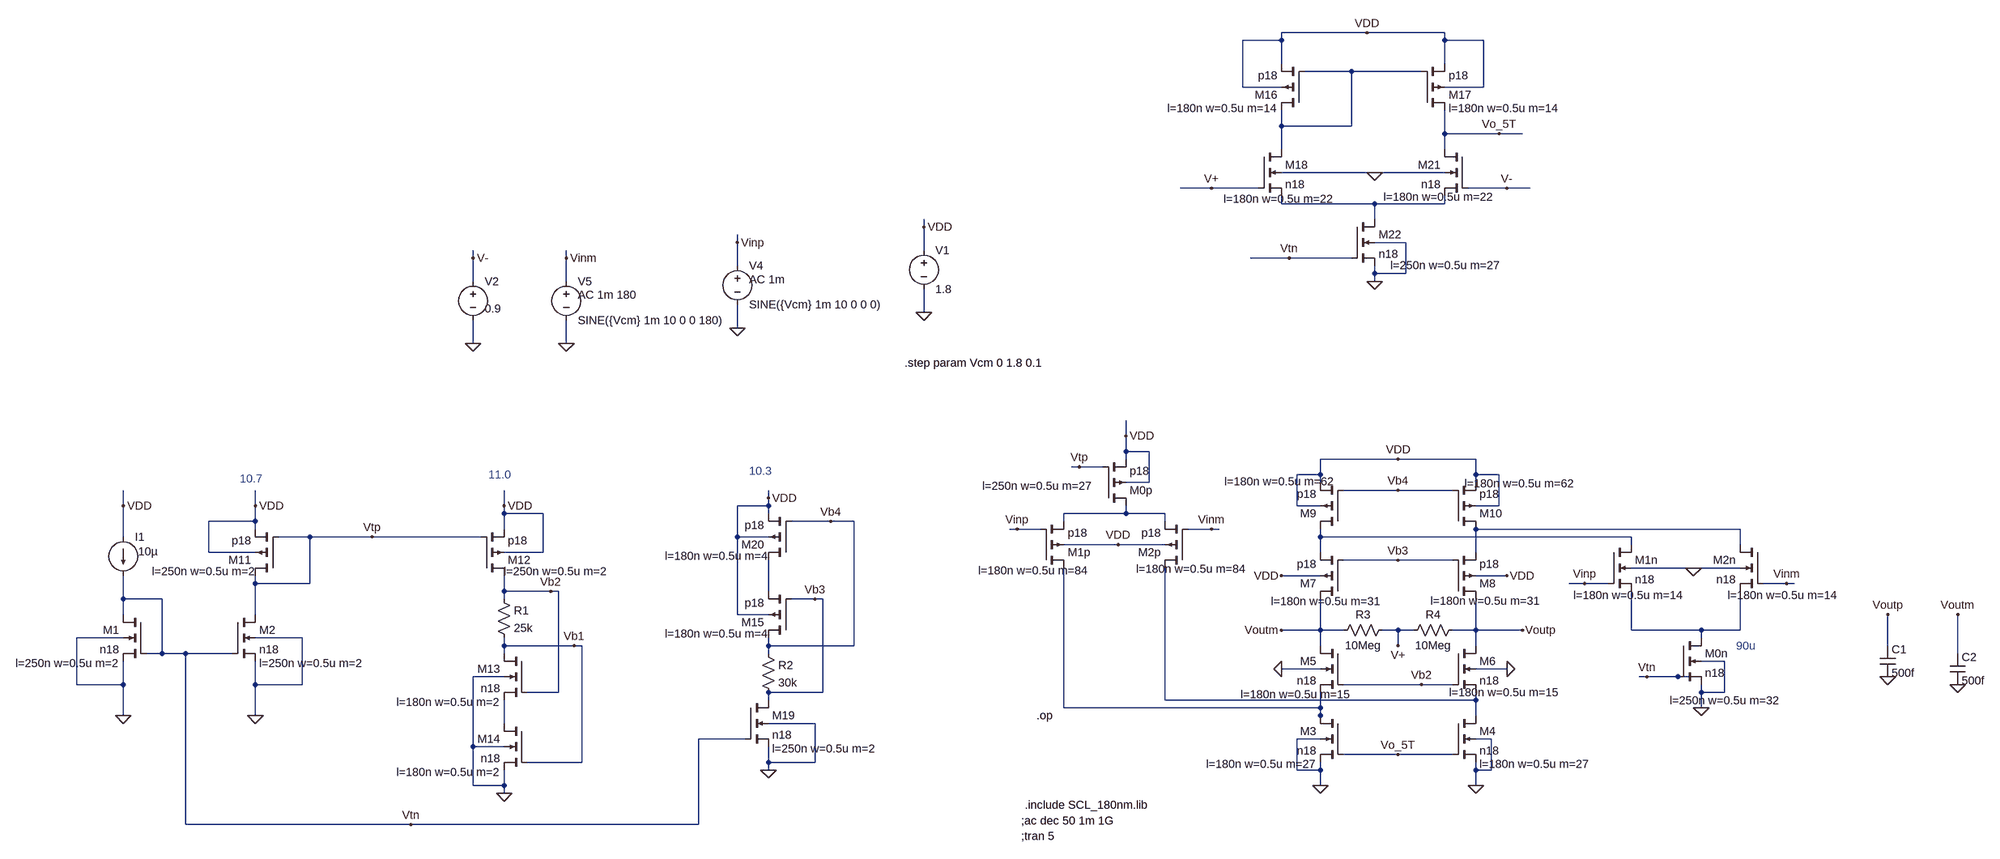
[diagram p0: schematic Rail to Rail Input Folded Cascode.asc]
Rail to Rail Input Folded Cascode.asc, the LTspice schematic file:
Version 4
SHEET 1 1728 680
WIRE 448 -1312 272 -1312
WIRE 608 -1312 448 -1312
WIRE 272 -1296 272 -1312
WIRE 272 -1296 192 -1296
WIRE 608 -1296 608 -1312
WIRE 688 -1296 608 -1296
WIRE 272 -1248 272 -1296
WIRE 608 -1248 608 -1296
WIRE 416 -1232 320 -1232
WIRE 560 -1232 416 -1232
WIRE 192 -1200 192 -1296
WIRE 272 -1200 192 -1200
WIRE 688 -1200 688 -1296
WIRE 688 -1200 608 -1200
WIRE 272 -1120 272 -1152
WIRE 416 -1120 416 -1232
WIRE 416 -1120 272 -1120
WIRE 608 -1104 608 -1152
WIRE 720 -1104 608 -1104
WIRE 768 -1104 720 -1104
WIRE 272 -1072 272 -1120
WIRE 608 -1072 608 -1104
WIRE 464 -1024 272 -1024
WIRE 608 -1024 464 -1024
WIRE 128 -992 64 -992
WIRE 224 -992 128 -992
WIRE 736 -992 656 -992
WIRE 784 -992 736 -992
WIRE 272 -960 272 -976
WIRE 464 -960 272 -960
WIRE 608 -960 608 -976
WIRE 608 -960 464 -960
WIRE 464 -928 464 -960
WIRE -464 -912 -464 -928
WIRE -848 -880 -848 -896
WIRE 528 -880 464 -880
WIRE -464 -864 -464 -912
WIRE -1392 -848 -1392 -864
WIRE -1200 -848 -1200 -864
WIRE 288 -848 208 -848
WIRE 416 -848 288 -848
WIRE -848 -832 -848 -880
WIRE 464 -816 464 -832
WIRE 528 -816 528 -880
WIRE 528 -816 464 -816
WIRE -1392 -800 -1392 -848
WIRE -1200 -800 -1200 -848
WIRE 464 -800 464 -816
WIRE -464 -736 -464 -784
WIRE -848 -704 -848 -752
WIRE -1392 -672 -1392 -720
WIRE -1200 -672 -1200 -720
WIRE -48 -352 -48 -384
WIRE -48 -320 -48 -352
WIRE 0 -320 -48 -320
WIRE -48 -304 -48 -320
WIRE 512 -304 352 -304
WIRE 672 -304 512 -304
WIRE -144 -288 -160 -288
WIRE -96 -288 -144 -288
WIRE 352 -272 352 -304
WIRE 352 -272 304 -272
WIRE 672 -272 672 -304
WIRE 720 -272 672 -272
WIRE 0 -256 0 -320
WIRE 0 -256 -48 -256
WIRE 352 -256 352 -272
WIRE 672 -256 672 -272
WIRE 512 -240 400 -240
WIRE 624 -240 512 -240
WIRE -784 -224 -784 -240
WIRE -2112 -208 -2112 -240
WIRE -1840 -208 -1840 -240
WIRE -1328 -208 -1328 -240
WIRE -784 -208 -784 -224
WIRE -784 -208 -848 -208
WIRE 304 -208 304 -272
WIRE 352 -208 304 -208
WIRE 720 -208 720 -272
WIRE 720 -208 672 -208
WIRE -1328 -192 -1328 -208
WIRE -1248 -192 -1328 -192
WIRE -784 -192 -784 -208
WIRE -48 -192 -48 -208
WIRE -48 -192 -176 -192
WIRE 32 -192 -48 -192
WIRE -1840 -176 -1840 -208
WIRE -1840 -176 -1936 -176
WIRE -656 -176 -736 -176
WIRE -608 -176 -656 -176
WIRE -176 -176 -176 -192
WIRE 32 -176 32 -192
WIRE -1840 -160 -1840 -176
WIRE -1328 -160 -1328 -192
WIRE -272 -160 -288 -160
WIRE -224 -160 -272 -160
WIRE 128 -160 80 -160
WIRE 144 -160 128 -160
WIRE 1216 -160 672 -160
WIRE -2112 -144 -2112 -208
WIRE -1728 -144 -1792 -144
WIRE -1600 -144 -1728 -144
WIRE -1376 -144 -1600 -144
WIRE -848 -144 -848 -208
WIRE -784 -144 -848 -144
WIRE 352 -144 352 -160
WIRE 992 -144 352 -144
WIRE -64 -128 -176 -128
WIRE 32 -128 -64 -128
WIRE 992 -128 992 -144
WIRE 1216 -128 1216 -160
WIRE -1936 -112 -1936 -176
WIRE -1840 -112 -1936 -112
WIRE -1248 -112 -1248 -192
WIRE -1248 -112 -1328 -112
WIRE 352 -112 352 -144
WIRE 672 -112 672 -160
WIRE 512 -96 400 -96
WIRE 624 -96 512 -96
WIRE 1120 -80 992 -80
WIRE 1216 -80 1120 -80
WIRE 352 -64 272 -64
WIRE 736 -64 672 -64
WIRE -1840 -48 -1840 -64
WIRE -1728 -48 -1728 -144
WIRE -1728 -48 -1840 -48
WIRE 896 -48 864 -48
WIRE 944 -48 896 -48
WIRE 1312 -48 1264 -48
WIRE 1328 -48 1312 -48
WIRE -1328 -32 -1328 -64
WIRE -1232 -32 -1328 -32
WIRE -1216 -32 -1232 -32
WIRE -784 -32 -784 -96
WIRE -2112 -16 -2112 -64
WIRE -2032 -16 -2112 -16
WIRE -1328 -16 -1328 -32
WIRE -688 -16 -736 -16
WIRE -672 -16 -688 -16
WIRE -2112 16 -2112 -16
WIRE -1840 16 -1840 -48
WIRE -848 16 -848 -144
WIRE -784 16 -848 16
WIRE 352 48 352 -16
WIRE 352 48 272 48
WIRE 400 48 352 48
WIRE 512 48 480 48
WIRE 544 48 512 48
WIRE 672 48 672 -16
WIRE 672 48 624 48
WIRE 768 48 672 48
WIRE 992 48 992 -32
WIRE 1136 48 992 48
WIRE 1216 48 1216 -32
WIRE 1216 48 1136 48
WIRE -2112 64 -2208 64
WIRE -1744 64 -1840 64
WIRE 1136 64 1136 48
WIRE -1328 80 -1328 64
WIRE -1184 80 -1328 80
WIRE -1168 80 -1184 80
WIRE -784 80 -784 64
WIRE -608 80 -608 -176
WIRE -608 80 -784 80
WIRE 352 80 352 48
WIRE 512 80 512 48
WIRE 672 80 672 48
WIRE 1520 80 1520 16
WIRE -2032 96 -2032 -16
WIRE -2032 96 -2064 96
WIRE -1984 96 -2032 96
WIRE -1888 96 -1984 96
WIRE -1328 96 -1328 80
WIRE -784 96 -784 80
WIRE 1664 96 1664 16
WIRE 1184 112 1136 112
WIRE 352 128 272 128
WIRE 736 128 672 128
WIRE -1328 144 -1392 144
WIRE 1024 144 1008 144
WIRE 1088 144 1024 144
WIRE 1120 144 1088 144
WIRE -2208 160 -2208 64
WIRE -2112 160 -2112 112
WIRE -2112 160 -2208 160
WIRE -1840 160 -1840 112
WIRE -1744 160 -1744 64
WIRE -1744 160 -1840 160
WIRE 560 160 400 160
WIRE 624 160 560 160
WIRE -1216 176 -1216 -32
WIRE -1216 176 -1280 176
WIRE -672 176 -672 -16
WIRE -672 176 -784 176
WIRE 1136 176 1136 160
WIRE 1184 176 1184 112
WIRE 1184 176 1136 176
WIRE -784 192 -784 176
WIRE 32 192 32 -80
WIRE 672 192 672 176
WIRE 672 192 32 192
WIRE -176 208 -176 -80
WIRE 352 208 352 176
WIRE 352 208 -176 208
WIRE 1136 208 1136 176
WIRE -2112 224 -2112 160
WIRE -1840 224 -1840 160
WIRE 352 224 352 208
WIRE 672 224 672 192
WIRE -1328 240 -1328 192
WIRE -688 240 -784 240
WIRE 352 240 352 224
WIRE -832 272 -928 272
WIRE 352 272 304 272
WIRE 704 272 672 272
WIRE -1392 288 -1392 144
WIRE -1328 288 -1392 288
WIRE 512 304 400 304
WIRE 624 304 512 304
WIRE -1168 320 -1168 80
WIRE -1168 320 -1280 320
WIRE -784 320 -784 288
WIRE -688 320 -688 240
WIRE -688 320 -784 320
WIRE -784 336 -784 320
WIRE 304 336 304 272
WIRE 352 336 352 320
WIRE 352 336 304 336
WIRE 672 336 672 320
WIRE 704 336 704 272
WIRE 704 336 672 336
WIRE -1392 368 -1392 288
WIRE -1328 368 -1328 336
WIRE -1328 368 -1392 368
WIRE 352 368 352 336
WIRE 672 368 672 336
WIRE -1328 384 -1328 368
WIRE -1984 448 -1984 96
WIRE -1520 448 -1984 448
WIRE -928 448 -928 272
WIRE -928 448 -1520 448
FLAG -48 -352 VDD
FLAG 352 368 0
FLAG 672 368 0
FLAG 1136 208 0
FLAG 512 -304 VDD
FLAG 272 -64 VDD
FLAG 736 -64 VDD
FLAG -64 -128 VDD
FLAG 736 128 0
FLAG 272 128 0
FLAG 1120 -80 0
FLAG -464 -736 0
FLAG -464 -912 VDD
FLAG 512 -96 Vb3
FLAG 512 -240 Vb4
FLAG -144 -288 Vtp
FLAG 1024 144 Vtn
FLAG 1312 -48 Vinm
FLAG 128 -160 Vinm
FLAG -272 -160 Vinp
FLAG 896 -48 Vinp
FLAG 272 48 Voutm
FLAG 768 48 Voutp
FLAG -848 -704 0
FLAG -848 -880 Vinp
FLAG -1200 -672 0
FLAG -1200 -848 Vinm
FLAG 1520 144 0
FLAG 1664 160 0
FLAG 1664 16 Voutm
FLAG 1520 16 Voutp
FLAG -2112 224 0
FLAG -2112 -208 VDD
FLAG -1840 224 0
FLAG -1840 -208 VDD
FLAG -1328 -208 VDD
FLAG -1328 384 0
FLAG -784 336 0
FLAG -784 -224 VDD
FLAG -656 -176 Vb4
FLAG -688 -16 Vb3
FLAG -1232 -32 Vb2
FLAG -1184 80 Vb1
FLAG -1600 -144 Vtp
FLAG -1520 448 Vtn
FLAG 560 160 Vb2
FLAG 464 -800 0
FLAG 720 -1104 Vo_5T
FLAG 448 -1312 VDD
FLAG 128 -992 V+
FLAG 736 -992 V-
FLAG 464 -1024 0
FLAG 288 -848 Vtn
FLAG -1392 -672 0
FLAG -1392 -848 V-
FLAG 512 80 V+
FLAG 512 304 Vo_5T
DATAFLAG 352 -144 ""
DATAFLAG 352 208 ""
DATAFLAG -48 -192 ""
DATAFLAG 1040 48 ""
DATAFLAG 304 48 ""
DATAFLAG 768 -1104 ""
SYMBOL pmos4 -96 -208 M180
WINDOW 123 -248 41 Left 2
SYMATTR Value2 l=250n w=0.5u m=27
SYMATTR InstName M0p
SYMATTR Value p18
SYMBOL pmos4 624 -16 M180
WINDOW 123 -45 -4 Left 2
SYMATTR Value2 l=180n w=0.5u m=31
SYMATTR InstName M8
SYMATTR Value p18
SYMBOL pmos4 400 -16 R180
WINDOW 123 -78 -5 Left 2
SYMATTR Value2 l=180n w=0.5u m=31
SYMATTR InstName M7
SYMATTR Value p18
SYMBOL pmos4 624 -160 M180
WINDOW 123 25 94 Left 2
SYMATTR Value2 l=180n w=0.5u m=62
SYMATTR InstName M10
SYMATTR Value p18
SYMBOL pmos4 400 -160 R180
WINDOW 123 18 98 Left 2
SYMATTR Value2 l=180n w=0.5u m=62
SYMATTR InstName M9
SYMATTR Value p18
SYMBOL nmos4 624 80 R0
WINDOW 123 -7 96 Left 2
SYMATTR Value2 l=180n w=0.5u m=15
SYMATTR InstName M6
SYMATTR Value n18
SYMBOL nmos4 624 224 R0
WINDOW 123 56 100 Left 2
SYMATTR Value2 l=180n w=0.5u m=27
SYMATTR InstName M4
SYMATTR Value n18
SYMBOL nmos4 400 80 M0
WINDOW 123 -15 100 Left 2
SYMATTR Value2 l=180n w=0.5u m=15
SYMATTR InstName M5
SYMATTR Value n18
SYMBOL nmos4 400 224 M0
WINDOW 123 56 100 Left 2
SYMATTR Value2 l=180n w=0.5u m=27
SYMATTR InstName M3
SYMATTR Value n18
SYMBOL pmos4 80 -80 R180
WINDOW 123 -120 -2 Left 2
SYMATTR Value2 l=180n w=0.5u m=84
SYMATTR InstName M2p
SYMATTR Value p18
SYMBOL pmos4 -224 -80 M180
WINDOW 123 -128 -5 Left 2
SYMATTR Value2 l=180n w=0.5u m=84
SYMATTR InstName M1p
SYMATTR Value p18
SYMBOL nmos4 1264 -128 M0
WINDOW 123 -154 104 Left 2
SYMATTR Value2 l=180n w=0.5u m=14
SYMATTR InstName M2n
SYMATTR Value n18
SYMBOL nmos4 944 -128 R0
WINDOW 123 -71 104 Left 2
SYMATTR Value2 l=180n w=0.5u m=14
SYMATTR InstName M1n
SYMATTR Value n18
SYMBOL nmos4 1088 64 R0
WINDOW 123 -17 129 Left 2
SYMATTR Value2 l=250n w=0.5u m=32
SYMATTR InstName M0n
SYMATTR Value n18
SYMBOL voltage -464 -880 R0
WINDOW 123 0 0 Left 0
WINDOW 39 0 0 Left 0
SYMATTR InstName V1
SYMATTR Value 1.8
SYMBOL voltage -848 -848 R0
WINDOW 123 24 44 Left 2
WINDOW 39 0 0 Left 0
SYMATTR Value2 AC 1m
SYMATTR InstName V4
SYMATTR Value SINE({Vcm} 1m 10 0 0 0)
SYMBOL voltage -1200 -816 R0
WINDOW 123 24 44 Left 2
WINDOW 39 0 0 Left 0
SYMATTR Value2 AC 1m 180
SYMATTR InstName V5
SYMATTR Value SINE({Vcm} 1m 10 0 0 180)
SYMBOL cap 1504 80 R0
SYMATTR InstName C1
SYMATTR Value 500f
SYMBOL cap 1648 96 R0
SYMATTR InstName C2
SYMATTR Value 500f
SYMBOL current -2112 -144 R0
WINDOW 123 0 0 Left 0
WINDOW 39 0 0 Left 0
WINDOW 3 31 30 Left 2
SYMATTR Value 10µ
SYMATTR InstName I1
SYMBOL nmos4 -2064 16 M0
WINDOW 123 56 100 Left 2
SYMATTR Value2 l=250n w=0.5u m=2
SYMATTR InstName M1
SYMATTR Value n18
SYMBOL nmos4 -1888 16 R0
WINDOW 123 56 100 Left 2
SYMATTR Value2 l=250n w=0.5u m=2
SYMATTR InstName M2
SYMATTR Value n18
SYMBOL pmos4 -1792 -64 R180
WINDOW 123 47 9 Left 2
SYMATTR Value2 l=250n w=0.5u m=2
SYMATTR InstName M11
SYMATTR Value p18
SYMBOL pmos4 -1376 -64 M180
WINDOW 123 47 9 Left 2
SYMATTR Value2 l=250n w=0.5u m=2
SYMATTR InstName M12
SYMATTR Value p18
SYMBOL res -1344 -32 R0
SYMATTR InstName R1
SYMATTR Value 25k
SYMBOL res -800 80 R0
SYMATTR InstName R2
SYMATTR Value 30k
SYMBOL nmos4 -1280 96 M0
WINDOW 123 56 100 Left 2
SYMATTR Value2 l=180n w=0.5u m=2
SYMATTR InstName M13
SYMATTR Value n18
SYMBOL nmos4 -1280 240 M0
WINDOW 123 56 100 Left 2
SYMATTR Value2 l=180n w=0.5u m=2
SYMATTR InstName M14
SYMATTR Value n18
SYMBOL pmos4 -736 64 R180
WINDOW 123 47 9 Left 2
SYMATTR Value2 l=180n w=0.5u m=4
SYMATTR InstName M15
SYMATTR Value p18
SYMBOL nmos4 -832 192 R0
WINDOW 123 56 100 Left 2
SYMATTR Value2 l=250n w=0.5u m=2
SYMATTR InstName M19
SYMATTR Value n18
SYMBOL pmos4 -736 -96 R180
WINDOW 123 47 9 Left 2
SYMATTR Value2 l=180n w=0.5u m=4
SYMATTR InstName M20
SYMATTR Value p18
SYMBOL res 496 32 R90
WINDOW 0 0 56 VBottom 2
WINDOW 3 32 56 VTop 2
SYMATTR InstName R3
SYMATTR Value 10Meg
SYMBOL res 640 32 R90
WINDOW 0 0 56 VBottom 2
WINDOW 3 32 56 VTop 2
SYMATTR InstName R4
SYMATTR Value 10Meg
SYMBOL pmos4 320 -1152 R180
WINDOW 123 56 4 Left 2
SYMATTR InstName M16
SYMATTR Value p18
SYMATTR Value2 l=180n w=0.5u m=14
SYMBOL pmos4 560 -1152 M180
WINDOW 123 56 4 Left 2
SYMATTR InstName M17
SYMATTR Value p18
SYMATTR Value2 l=180n w=0.5u m=14
SYMBOL nmos4 224 -1072 R0
WINDOW 123 -71 102 Left 2
SYMATTR InstName M18
SYMATTR Value n18
SYMATTR Value2 l=180n w=0.5u m=22
SYMBOL nmos4 656 -1072 M0
WINDOW 123 -53 98 Left 2
SYMATTR InstName M21
SYMATTR Value n18
SYMATTR Value2 l=180n w=0.5u m=22
SYMBOL nmos4 416 -928 R0
WINDOW 123 80 95 Left 2
SYMATTR InstName M22
SYMATTR Value n18
SYMATTR Value2 l=250n w=0.5u m=27
SYMBOL voltage -1392 -816 R0
WINDOW 123 24 44 Left 2
WINDOW 39 0 0 Left 0
WINDOW 3 24 72 Left 2
SYMATTR InstName V2
SYMATTR Value 0.9
TEXT -256 408 Left 2 !.include SCL_180nm.lib
TEXT 1208 80 Left 2 ;90u
TEXT -232 224 Left 2 !.op
TEXT -1872 -264 Left 2 ;10.7
TEXT -1360 -272 Left 2 ;11.0
TEXT -824 -280 Left 2 ;10.3
TEXT -264 440 Left 2 !;ac dec 50 1m 1G
TEXT -264 472 Left 2 !;tran 5
TEXT -504 -632 Left 2 !.step param Vcm 0 1.8 0.1

The netlist it stands for:
* Rail to Rail Input Folded Cascode.asc
M0p N003 Vtp VDD VDD p18 l=250n w=0.5u m=27
M8 Voutp Vb3 N004 VDD p18 l=180n w=0.5u m=31
M7 Voutm Vb3 N005 VDD p18 l=180n w=0.5u m=31
M10 N004 Vb4 VDD VDD p18 l=180n w=0.5u m=62
M9 N005 Vb4 VDD VDD p18 l=180n w=0.5u m=62
M6 Voutp Vb2 N008 0 n18 l=180n w=0.5u m=15
M4 N008 Vo_5T 0 0 n18 l=180n w=0.5u m=27
M5 Voutm Vb2 N009 0 n18 l=180n w=0.5u m=15
M3 N009 Vo_5T 0 0 n18 l=180n w=0.5u m=27
M2p N008 Vinm N003 VDD p18 l=180n w=0.5u m=84
M1p N009 Vinp N003 VDD p18 l=180n w=0.5u m=84
M2n N004 Vinm N007 0 n18 l=180n w=0.5u m=14
M1n N005 Vinp N007 0 n18 l=180n w=0.5u m=14
M0n N007 Vtn 0 0 n18 l=250n w=0.5u m=32
V1 VDD 0 1.8
V4 Vinp 0 SINE({Vcm} 1m 10 0 0 0) AC 1m
V5 Vinm 0 SINE({Vcm} 1m 10 0 0 180) AC 1m 180
C1 Voutp 0 500f
C2 Voutm 0 500f
I1 VDD Vtn 10µ
M1 Vtn Vtn 0 0 n18 l=250n w=0.5u m=2
M2 Vtp Vtn 0 0 n18 l=250n w=0.5u m=2
M11 Vtp Vtp VDD VDD p18 l=250n w=0.5u m=2
M12 Vb2 Vtp VDD VDD p18 l=250n w=0.5u m=2
R1 Vb2 Vb1 25k
R2 Vb4 Vb3 30k
M13 Vb1 Vb2 N010 0 n18 l=180n w=0.5u m=2
M14 N010 Vb1 0 0 n18 l=180n w=0.5u m=2
M15 Vb4 Vb3 N006 VDD p18 l=180n w=0.5u m=4
M19 Vb3 Vtn 0 0 n18 l=250n w=0.5u m=2
M20 N006 Vb4 VDD VDD p18 l=180n w=0.5u m=4
R3 V+ Voutm 10Meg
R4 Voutp V+ 10Meg
M16 N001 N001 VDD VDD p18 l=180n w=0.5u m=14
M17 Vo_5T N001 VDD VDD p18 l=180n w=0.5u m=14
M18 N001 V+ N002 0 n18 l=180n w=0.5u m=22
M21 Vo_5T V- N002 0 n18 l=180n w=0.5u m=22
M22 N002 Vtn 0 0 n18 l=250n w=0.5u m=27
V2 V- 0 0.9
.model NMOS NMOS
.model PMOS PMOS
.lib standard.mos
.include SCL_180nm.lib
* 90u
.op
* 10.7
* 11.0
* 10.3
;ac dec 50 1m 1G
;tran 5
.step param Vcm 0 1.8 0.1
.backanno
.end